# Altium project Merigold.PrjPcb
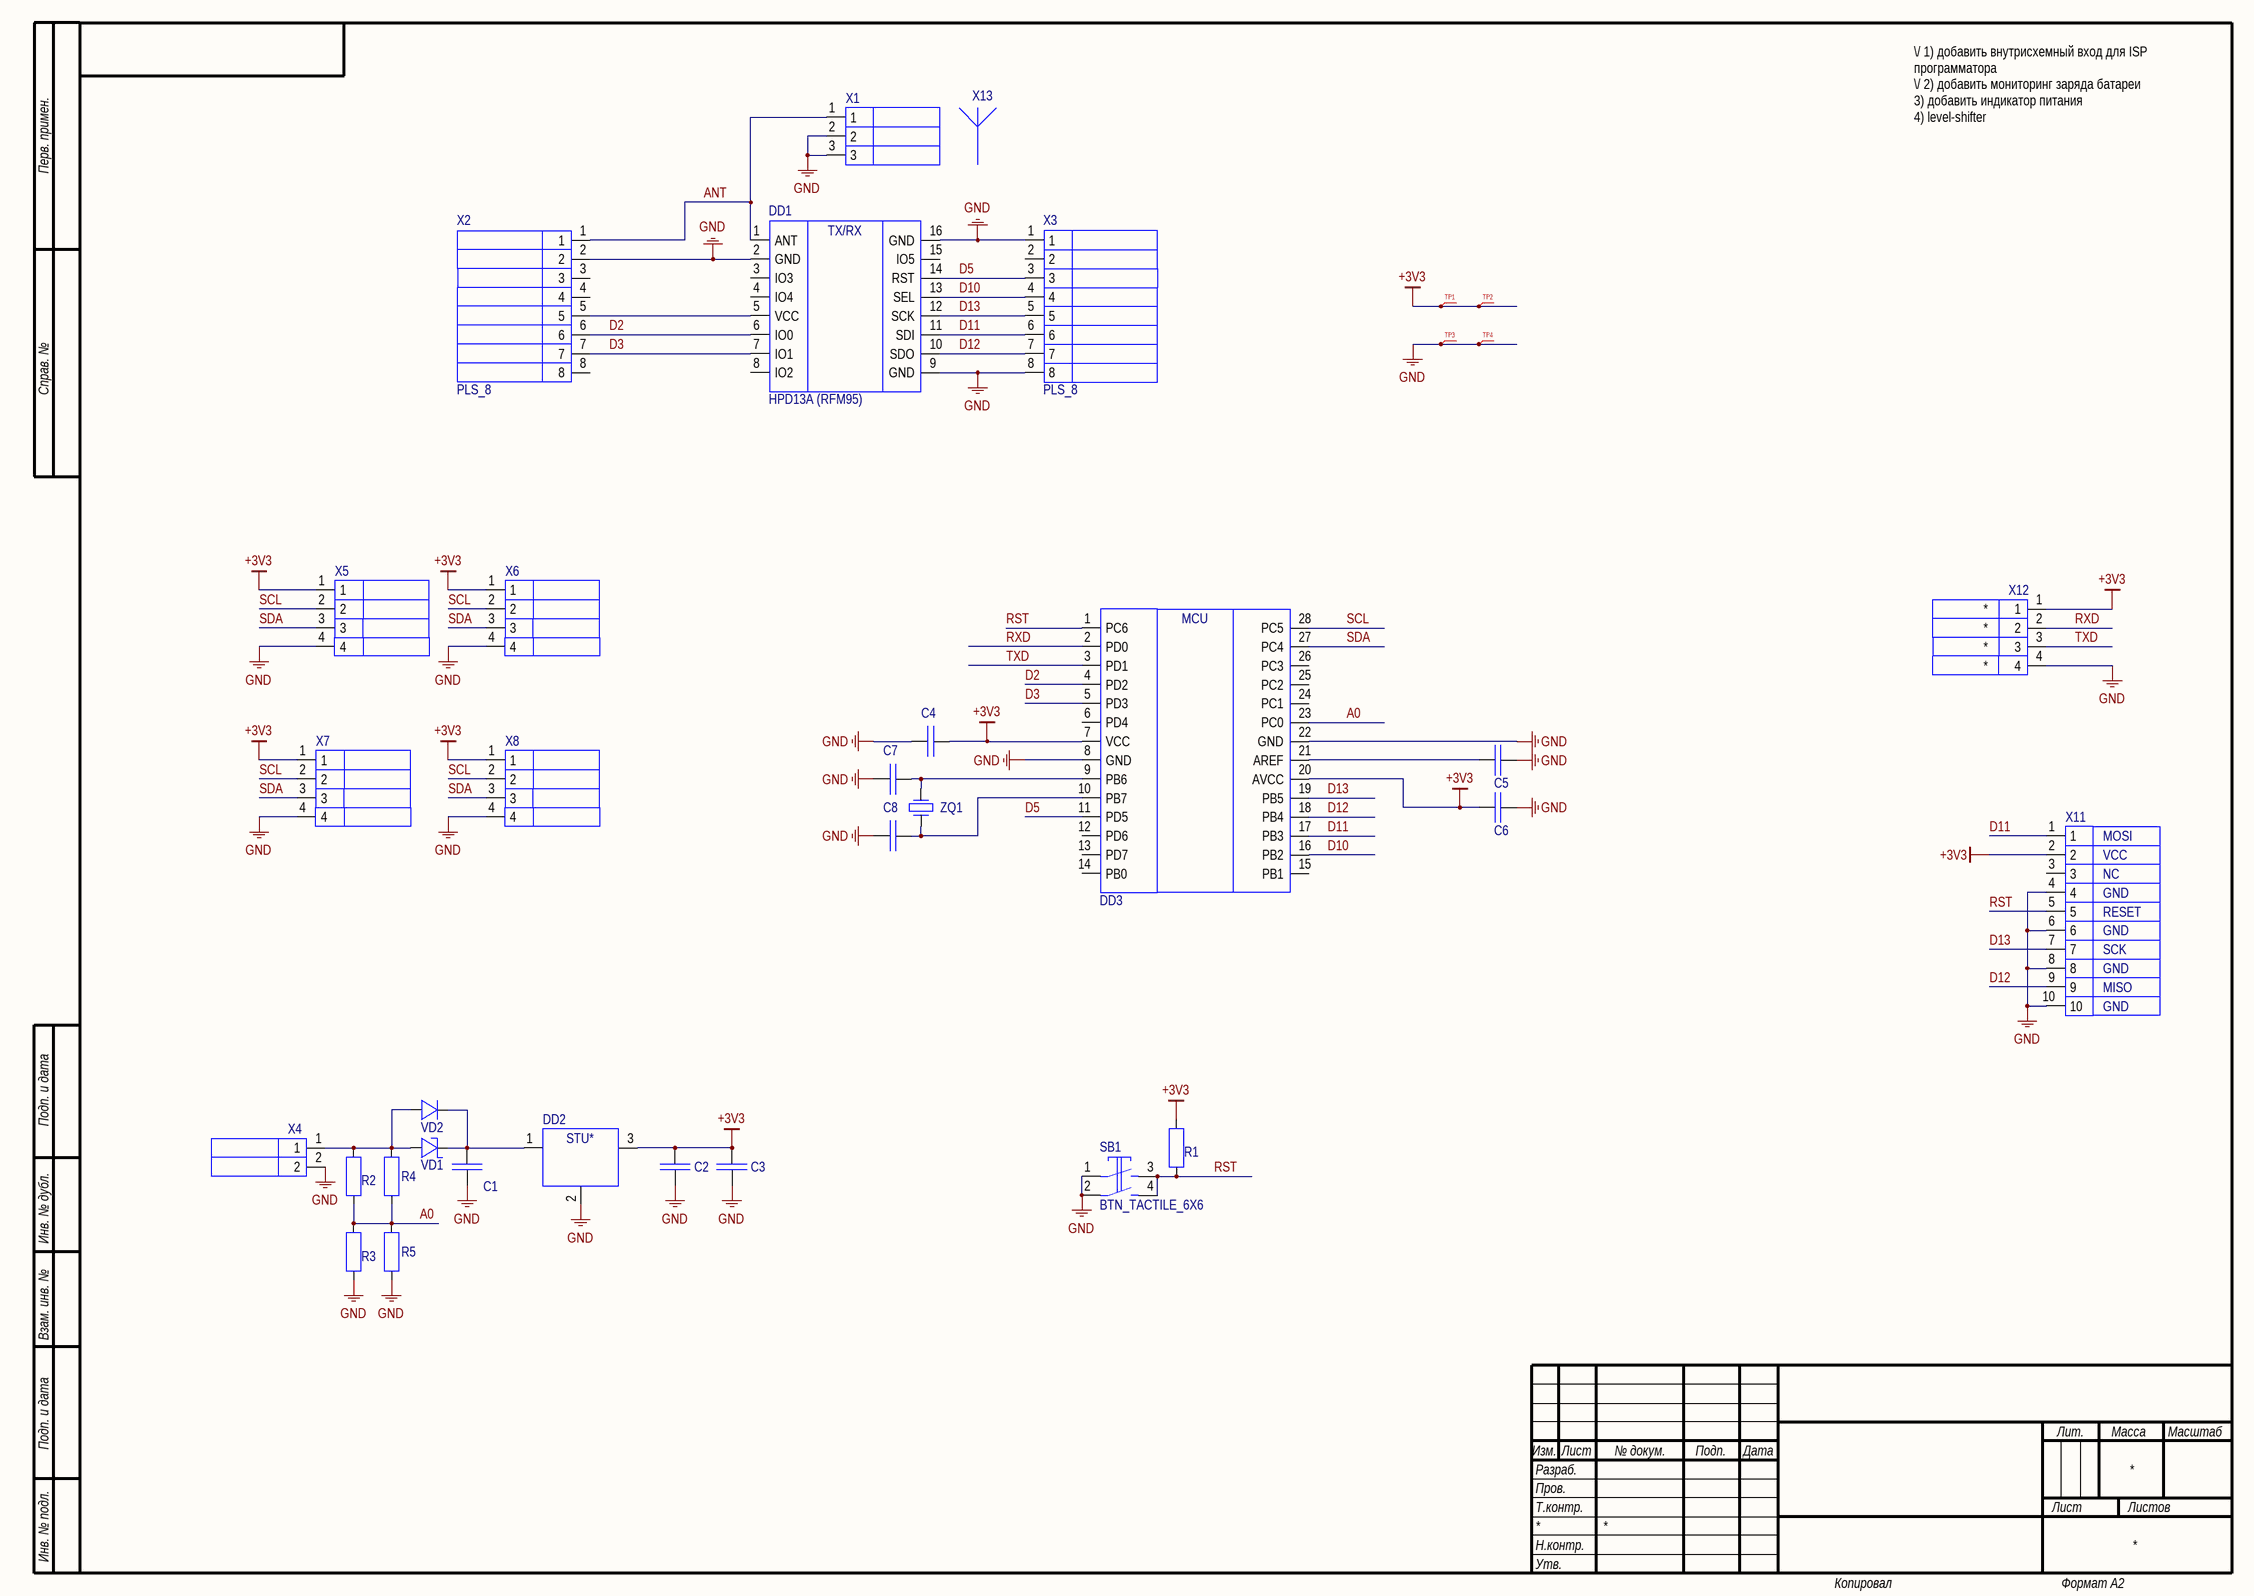
[diagram p0: merigold.SchDoc]
1 sheet, 35 parts. Net scope: global (net labels, ports and power ports of the same name join across sheets).
Board files: merigold.PcbDoc, merigold board array.PcbDoc, merigold_v1.PcbDoc

## Sheet merigold.SchDoc
size 594 x 420 mm; PageSetup: Record=PageOptions|CenterHorizontal=True|CenterVertical=True|PrintScale=0.94|XCorrection=1.00|YCorrection=1.00|PrintKind=1|BorderSize=5000000|LeftOffset=0|BottomOffset=0|Orientation=1|PaperLength=1000|PaperWidth=1000|Scale=100|PaperSource=7|PrintQuality=-4|MediaType=1|DitherType=10|PaperKind=A4|PrintScaleMode=1; DecimalNumber: Децимальный номер; HeadOfSector: Нач. сектора; MainDevice: Перв.примен.; Name: Наименование

### Parts
C1  10U10V_CAPC  [CAPC2012X14M/0805]  (value not drawn)
C2  10U10V_CAPC  [CAPC2012X14M/0805]  (value not drawn)
C3  1U16V_CAPC  [CAPC2012X14M/0805]  (value not drawn)
C4  1U16V_CAPC  [CAPC2012X14M/0805]  (value not drawn)
C5  1U16V_CAPC  [CAPC2012X14M/0805]  (value not drawn)
C6  1U16V_CAPC  [CAPC2012X14M/0805]  (value not drawn)
C7  22P250V_CAPC  [CAPC2012X14M/0805]  (value not drawn)
C8  22P250V_CAPC  [CAPC2012X14M/0805]  (value not drawn)
DD1  HPD13A (RFM95)  [SOJ200P1600X200-16M]
DD2  LM1117MPX-3.3/NOPB  [SOT230P700X180-4M]  (value not drawn)
DD3  ATMEGA328  [PDIP28]  (value not drawn)
R1  10K1206  [RESC3216X07N/1206]  (value not drawn)
R2  RNF14FTD100K  [RESAD800W55L600D230]  (value not drawn)
R3  RNF14FTD100K  [RESAD800W55L600D230]  (value not drawn)
R4  100K0603  [RESC1608X06N/0603]  (value not drawn)
R5  100K0603  [RESC1608X06N/0603]  (value not drawn)
SB1  BTN_TACTILE_6X6  [BTN_TACTILE_6X6]
TP1  TP_TH  [TH_TP]  (value not drawn)
TP2  TP_TH  [TH_TP]  (value not drawn)
TP3  TP_TH  [TH_TP]  (value not drawn)
TP4  TP_TH  [TH_TP]  (value not drawn)
VD1  MBR120VLSFT1G  [SOD-123]  (value not drawn)
VD2  HER107G R0G  [DO-204AL]  (value not drawn)
X1  U.FL-R-SMT-1_sch  [U.FL-R-SMT-1]  (value not drawn)
X2  PLS_8  [PLS_8]
X3  PLS_8  [PLS_8]
X4  2EDGV-5.0-02P  [2EDGV-5.0-02P]  (value not drawn)
X5  2EDGV-5.0-04P  [2EDGV-5.0-04P]  (value not drawn)
X6  2EDGV-5.0-04P  [2EDGV-5.0-04P]  (value not drawn)
X7  2EDGV-5.0-04P  [2EDGV-5.0-04P]  (value not drawn)
X8  2EDGV-5.0-04P  [2EDGV-5.0-04P]  (value not drawn)
X11  ISP  [302_SERIES_10POS]  (value not drawn)
X12  61300411121  [PLS_4]  (value not drawn)
X13  ANT-8WPIG-UFL  (value not drawn)  (mechanical)
ZQ1  HC49U-8-30-50-70-30-ATF  [XTAL1050X465X350]  (value not drawn)

### Nets
+3V3: C2.2 C3.2 C4.2 C6.1 DD2.3(OUT) DD3.7(VCC) DD3.20(AVCC) R1.2 TP1.1(TP) TP2.1(TP) X5.1 X6.1 X7.1 X8.1 X11.2 X12.1
GND: C1.1 C2.1 C3.1 C4.1 C5.2 C6.2 C7.1 C8.1 DD1.2(GND) DD1.9(GND) DD1.16(GND) DD2.2(GND) DD3.8(GND) DD3.22(GND) R3.1 R5.1 SB1.1 SB1.2 TP3.1(TP) TP4.1(TP) X1.2 X1.3 X2.2 X3.1 X3.8 X4.2 X5.4 X6.4 X7.4 X8.4 X11.4 X11.6 X11.8 X11.10 X12.4
A0: DD3.23(PC0) R2.1 R3.2 R4.1 R5.2
ANT: DD1.1(ANT) X1.1 X2.1
D2: DD1.6(IO0) DD3.4(PD2) X2.6
D3: DD1.7(IO1) DD3.5(PD3) X2.7
D5: DD1.14(RST) DD3.11(PD5) X3.3
D10: DD1.13(SEL) DD3.16(PB2) X3.4
D11: DD1.11(SDI) DD3.17(PB3) X3.6 X11.1
D12: DD1.10(SDO) DD3.18(PB4) X3.7 X11.9
D13: DD1.12(SCK) DD3.19(PB5) X3.5 X11.7
RST: DD3.1(PC6) R1.1 SB1.3 SB1.4 X11.5
RXD: DD3.2(PD0) X12.2
SCL: DD3.28(PC5) X5.2 X6.2 X7.2 X8.2
SDA: DD3.27(PC4) X5.3 X6.3 X7.3 X8.3
TXD: DD3.3(PD1) X12.3
NetC1_2: C1.2 DD2.1(IN) VD1.K VD2.K
NetC5_1: C5.1 DD3.21(AREF)
NetC7_2: C7.2 DD3.9(PB6) ZQ1.2
NetC8_2: C8.2 DD3.10(PB7) ZQ1.1
NetDD1_5: DD1.5(VCC) X2.5
NetR2_2: R2.2 R4.2 VD1.A VD2.A X4.1

Not connected (* = marked no-connect by the designer): DD1 3(IO3) 4(IO4) 8(IO2) 15(IO5); DD3 6(PD4) 12(PD6) 13(PD7) 14(PB0) 15(PB1) 24(PC1) 25(PC2) 26(PC3); X2 3 4 8; X3 2; X11 3

### Notes on the sheet
- \/ 1) добавить внутрисхемный вход для ISP программатора
  \/ 2) добавить мониторинг заряда батареи
  3) добавить индикатор питания
  4) level-shifter
- Перв. примен.
- Справ. №
- Подп. и дата
- Инв. № дубл.
- Взам. инв. №
- Разраб.
- Изм.
- Лист
- № докум.
- Подп.
- Дата
- Лит.
- Масса
- Масштаб
- Пров.
- Т.контр.
- Листов
- Инв. № подл.
- Утв.
- Н.контр.
- Копировал
- Формат А2
- (in symbol AMS1117) STU*
- (in symbol ATMEGA328P-PU) MCU
- (in symbol HPD13A (RFM95)) TX/RX
- (in symbol ISP) MOSI; VCC; NC; GND; RESET; SCK; MISO

### Library data of the parts
C1 C2 = 10U10V_CAPC: CAP CER 10UF 10V X5R 0805; Manufacturer: Samsung Electro-Mechanics; Manufacturer Part Number: CL21A106KPFNNNG; Capacitance: 10 µF
C3-C6 = 1U16V_CAPC: CAP CER 1UF 16V X7R 0805; Manufacturer: Murata Manufacturing; Manufacturer Part Number: GRM21BR71C105KA01K; Capacitance: 1 µF
C7 C8 = 22P250V_CAPC: CAP CER 22PF 250V C0G/NP0 0805; Manufacturer: Murata Manufacturing; Manufacturer Part Number: GRM21A5C2E220JW01; Capacitance: 22 pF
DD1 = HPD13A (RFM95): RF TXRX MODULE ISM<1GHZ; Manufacturer: RF Solutions; Manufacturer Part Number: RFM95W-868S2; Category: RF/IF and RFID
DD2 = AMS1117: IC REG LIN 3.3V 800MA SOT223-4; Manufacturer: Texas Instruments; Manufacturer Part Number: LM1117MPX-3.3/NOPB
DD3 = ATMEGA328P-PU: IC MCU 8BIT 32KB FLASH 28DIP; Manufacturer: Microchip / Atmel; Manufacturer Part Number: ATMEGA328P-PU
R1 = 10K1206: RES SMD 10K OHM 1% 1/4W 1206; Manufacturer: Panasonic; Manufacturer Part Number: ERJ8ENF1002V; Rated Power: 0.25 W; Resistance: 10 kO; Tolerance (%): ±1 %
R2 R3 = 100K_AD800W55L600D230: RES 100K OHM 1/4W 5% AXIAL; Manufacturer: Stackpole Electronics; Power (Watts): 0.25W, 1/4W; Category: Resistors; Manufacturer Part Number: RNF14FTD100K; Resistance (Ohms): 100k
R4 R5 = 100K0603: RES SMD 100K OHM 1% 1/4W 0603; Manufacturer Part Number: ESR03EZPF1003; Manufacturer: ESR03EZPF1003
SB1 = BTN_TACTILE_6X6: SWITCH TACTILE SPST-NO 0.05A 24V; Manufacturer: TE Connectivity Alcoswitch; Manufacturer Part Number: 1825910-6; Pole Throw Configuration: SPST
TP1-TP4 = TP_TH: TEST POINT THROUGH HOLE
VD1 = MBR120VLSFT1G: DIODE SCHOTTKY 20V 1A SOD123FL; Manufacturer: ON Semiconductor; Manufacturer Part Number: MBR120VLSFT1G
VD2 = HER107G R0G: DIODE GEN PURP 800V 1A DO204AL; Manufacturer: Taiwan Semiconductor Corporation; Manufacturer Part Number: HER107G R0G
X1 = U.FL-R-SMT-1_sch: CONN U.FL RCPT STR 50 OHM SMD; Manufacturer: Hirose; Manufacturer Part Number: U.FL-R-SMT-1(10); Category: Connectors, Interconnects
X2 X3 = PLS_8: CONN HEADER VERT 8POS 2.54MM; Manufacturer: Harwin; Manufacturer Part Number: M20-7820842; Number of Contacts: 8; Number of Rows: 1; Pitch: 2.54 mm; Category: Connector Headers and PCB Receptacles
X4 = 2EDGV-5.0-02P: TERM BLOCK HDR 2POS VERT 5MM; Manufacturer: Phoenix Contact; Manufacturer Part Number: 1753437
X5-X8 = 2EDGV-5.0-04P: TERM BLOCK HDR 4POS VERT 5MM; Manufacturer: Phoenix Contact; Manufacturer Part Number: 1753479
X11 = ISP: CONN HEADER VERT 10POS 2.54MM; ManufacturerPartNumber: 302-S101; Manufacturer: On-Shore Technology; Number of Positions: 10; Pitch: 0.100" (2.54mm); Manufacturer Part Number: 302-S101; Number of Rows: 2; Category: Connectors, Interconnects
X12 = PLS_4: CONN HEADER VERT 4POS 2.54MM; Manufacturer: Wurth Electronics; Number of Contacts: 3; Pitch: 0.100" (2.54mm); Number of Rows: 1; Manufacturer Part Number: 61300411121; Category: Connectors, Interconnects; Number of Positions: 3; 1: *; 2: *; 3: *; 4: *
X13 = ANT-8WPIG-UFL: RF ANT 868MHZ WHIP STR U.FL 50MM; Manufacturer: RF Solutions; Category: RF/IF and RFID; Manufacturer Part Number: ANT-8WPIG-UFL
ZQ1 = HC49U-8-30-50-70-30-ATF: CRYSTAL 8.0MHZ 30PF SMD; Manufacturer: IQD Frequency Products; Frequency: 8 MHz; Manufacturer Part Number: HC49U-8-30-50-70-30-ATF; Load Capacitance: 30 pF; Category: Crystals

## Assembly variants
Variant of Merigold: all parts fitted